# EAGLE design LedLys (EAGLE 9.6.2)
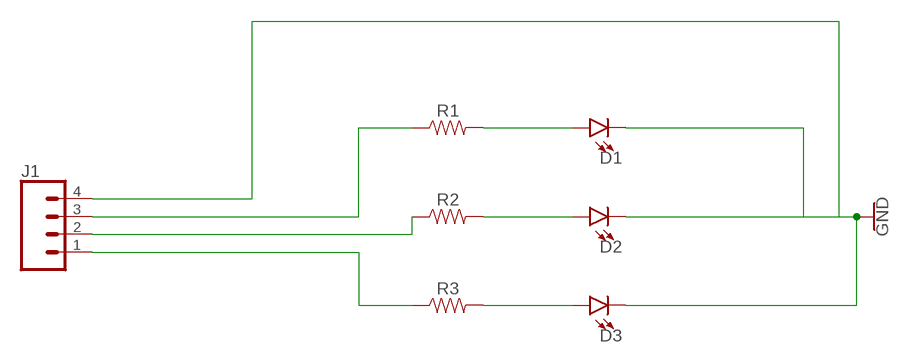
[diagram p0: schematic, sheet 1]

## Parts
D1  LED-3MM-NO_SILK  [LED_3MM-NS]
D2  LED-3MM-NO_SILK  [LED_3MM-NS]
D3  LED-3MM-NO_SILK  [LED_3MM-NS]
J1  CONN_04LOCK  [1X04_LOCK]
R1  RESISTORAXIAL-0.3  [AXIAL-0.3]
R2  RESISTORAXIAL-0.3  [AXIAL-0.3]
R3  RESISTORAXIAL-0.3  [AXIAL-0.3]

## Nets
GND: D1.K(C) D2.K(C) D3.K(C) J1.4
N$1: D1.A R1.P$2
N$2: J1.3 R1.P$1
N$3: J1.2 R2.P$1
N$4: J1.1 R3.P$1
N$5: D2.A R2.P$2
N$6: D3.A R3.P$2

## Library data of the parts
D1-D3 = SparkFun-LED:LED: LED (Generic) Standard schematic elements and footprints for 5mm, 3mm, 1206, and 0603 sized LEDs. Generic LEDs with no color specified.
J1 = SparkFun-Connectors:CONN_04: Multi connection point. Often used as Generic Header-pin footprint for 0.1 inch spaced/style header connections On any of the 0.1 inch spaced packages, you can populate with these: Break Away Headers - Straight <https://www.sparkfun.com/products/116> (PRT-00116) Break Away Male Headers - Right Angle <https://www.sparkfun.com/products/553> (PRT-00553) Female Headers <https://www.sparkfun.com/products/115> (PRT-00115) Break Away Headers - Machine Pin <https://www.sparkfun.com/products/117> (PRT-00117) Break Away Female Headers - Swiss Machine Pin <https://www.sparkfun.com/products/743> (PRT-00743) For SCREWTERMINALS and SPRING TERMINALS visit here: Screw Terimnals on SparkFun.com <https://www.sparkfun.com/search/results?term=Screw+Terminals> (5mm/3.5mm/2.54mm spacing) This device is also useful as a general connection point to wire up your design to another part of your project. Our various solder wires solder well into these plated through hole pads. Hook-Up Wire - Assortment (Stranded, 22 AWG) <https://www.sparkfun.com/products/11375> (PRT-11375) Hook-Up Wire - Assortment (Solid Core, 22 AWG) <https://www.sparkfun.com/products/11367> (PRT-11367) View the entire wire category on our website here <https://www.sparkfun.com/categories/141> Special notes: Molex polarized connector foot print use with SKU : PRT-08231 with associated crimp pins and housings. 1MM SMD Version SKU: PRT-10208; PROD_ID: CONN-09696
R1-R3 = SparkFun-Resistors:RESISTOR: Generic Resistor Package

## Board
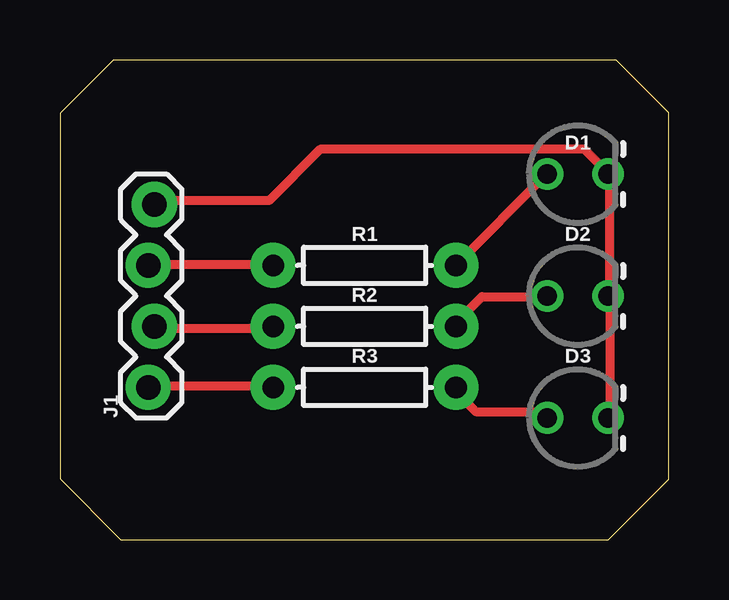
[diagram p1: board, top side]

Size 25.38 x 19.99 mm. Coordinates in mm from the lower left corner, seen from the top.
Outline: 0,17.78 0,2.54 2.54,0 22.86,0 25.38,2.52 25.38,17.8 23.19,19.99 2.21,19.99 0,17.78
Copper layers (1*16): Top 0.035mm / dielectric 1.5mm / Bottom 0.035mm
Design rules "default *": minimum track width 15mil, minimum drill 0.35mm, track to track 6mil, track to pad 6mil, pad to pad 6mil, via to via 6mil, smd to smd 6mil, copper to edge 40mil, drill to drill 6mil, minimum pad ring 10mil, minimum via ring 8mil, stop-mask expansion 4mil, vias tented up to drill 0mil, thermal gap 10mil

### Footprints (pad centres in the part's own frame; a part is rotated, then mirrored left to right if it is on the bottom)
LED_3MM-NS = drill 0.813: A -1.27,0; K 1.27,0
1X04_LOCK = drill 1.016 pad 1.88: 1 0,0.127; 2 2.54,-0.127; 3 5.08,0.127; 4 7.62,-0.127
AXIAL-0.3 = drill 0.9 pad 1.88: P$1 -3.81,0; P$2 3.81,0

### Placement (x,y rotation side)
D1  21.59,15.24 0 top
D2  21.59,10.16 0 top
D3  21.59,5.08 0 top
J1  3.81,6.35 90 top
R1  12.7,11.43 0 top
R2  12.7,8.89 0 top
R3  12.7,6.35 0 top

### Tracks (layer width: path | path; a pad name or v marks a point on that pad's centre or on a via)
GND
  Top 0.381: D3.K 22.94,5.33 22.94,10.13 D2.K 22.94,10.4 22.94,15.2 D1.K 22.67,15.47 21.87,16.27 10.85,16.27 8.71,14.13 4,14.13 J1.4
N$1
  Top 0.381: D1.A 20.27,15.2 16.54,11.47 R1.P$2
N$2
  Top 0.381: J1.3 3.73,11.47 8.8,11.47 R1.P$1
N$3
  Top 0.381: J1.2 4,8.8 8.8,8.8 R2.P$1
N$4
  Top 0.381: J1.1 3.73,6.4 8.8,6.4 R3.P$1
N$5
  Top 0.381: D2.A 20.27,10.13 17.6,10.13 16.54,9.07 R2.P$2
N$6
  Top 0.381: D3.A 20.27,5.33 17.34,5.33 16.54,6.13 R3.P$2